# EAGLE schematic final_pcb (EAGLE 9.7.0)
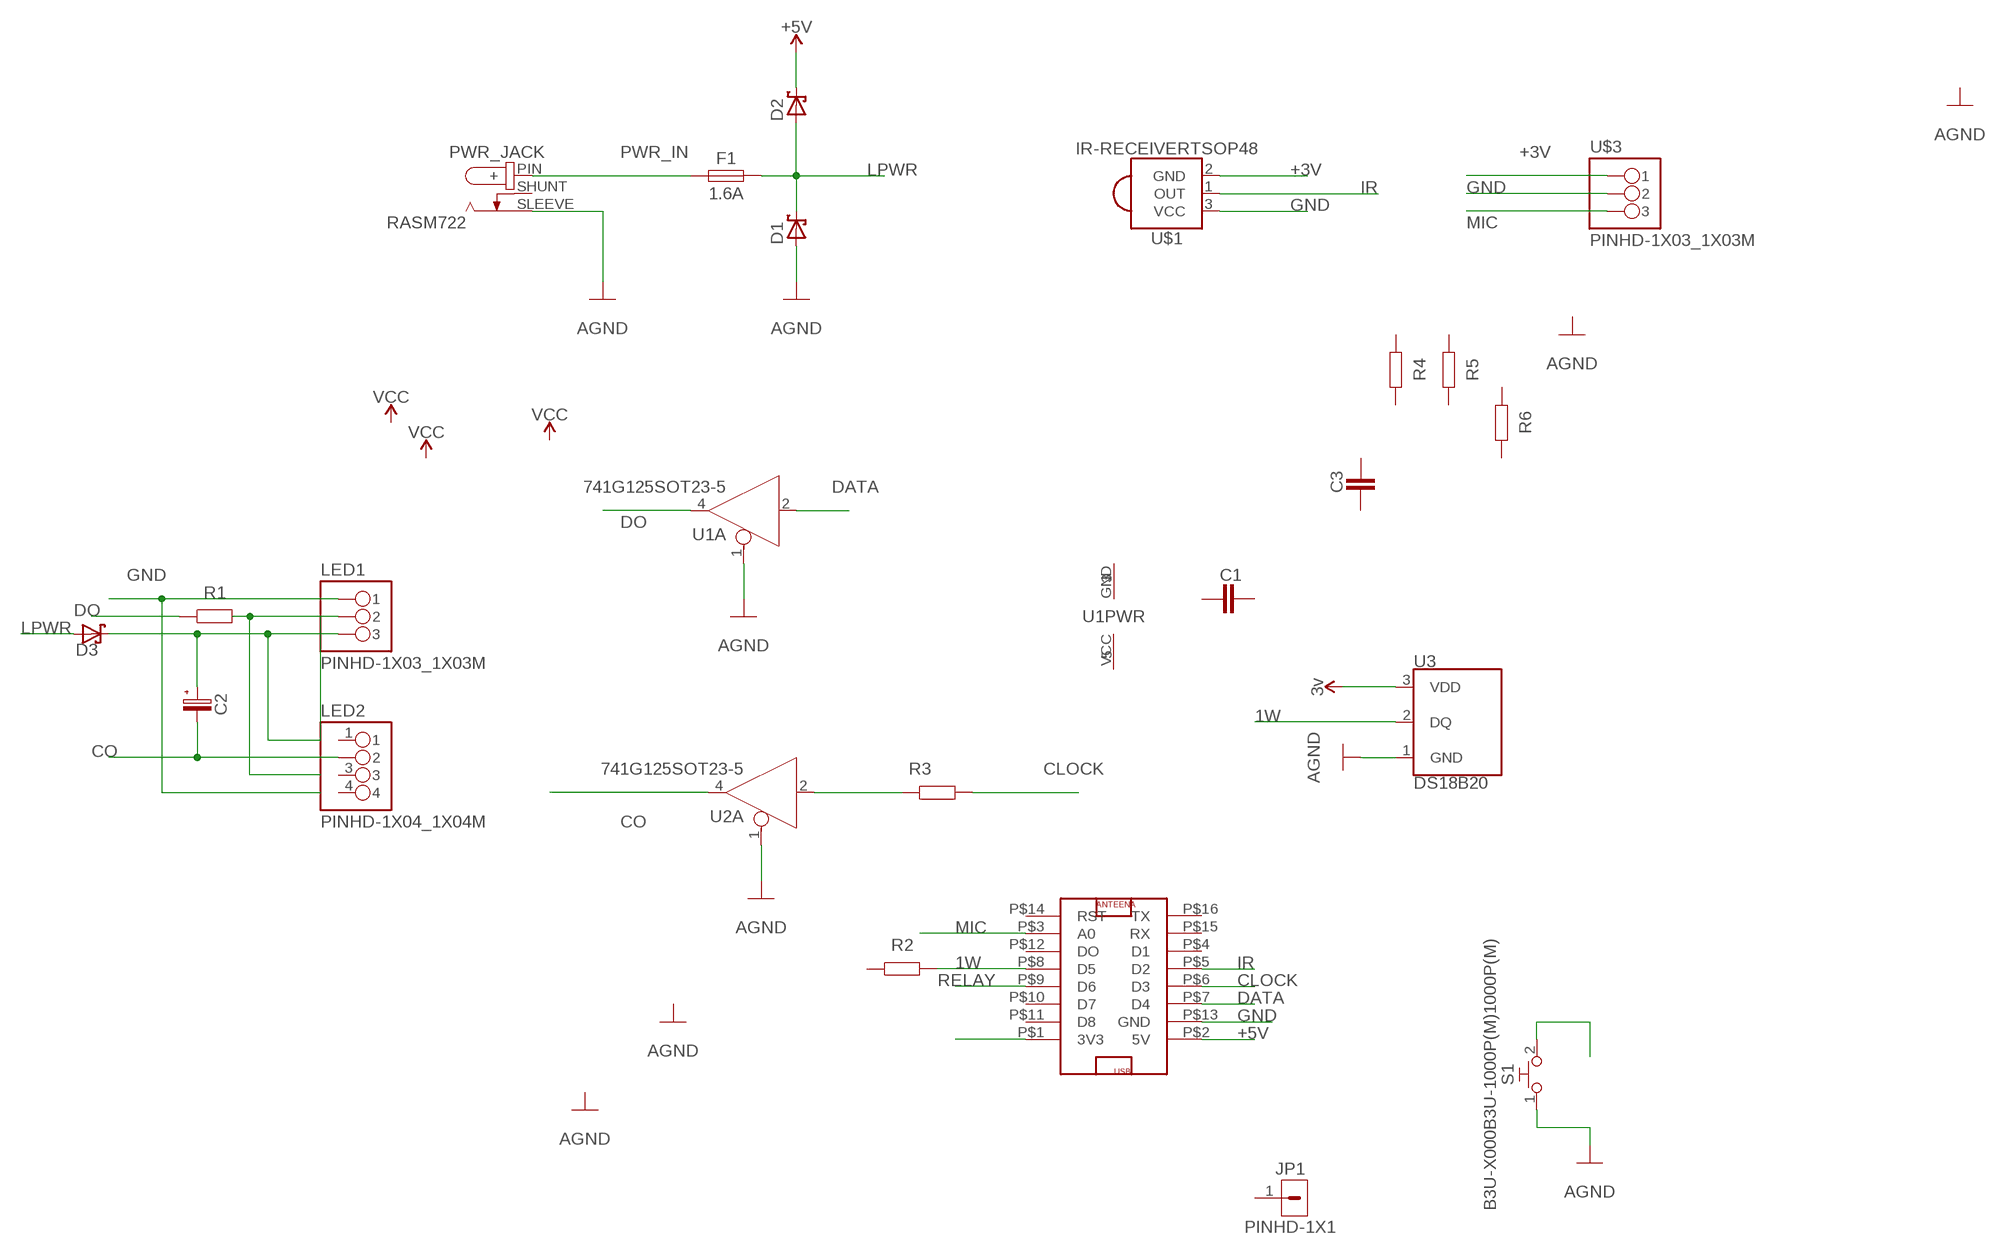
[diagram p0: schematic, sheet 1]

## Parts
C1  CAPACITOR_CHIP-0402(1005-METRIC)  [CAPC1005X60]
C2  C-POL_TANTALUM-1206(3216-METRIC)  [CAPMP3216X180N]
C3  CAPACITOR_CHIP-0402(1005-METRIC)  [CAPC1005X60]
D1  SCHOTTKY-DIODEDO13M  [DO13M]
D2  SCHOTTKY-DIODEDO13M  [DO13M]
D3  SCHOTTKY-DIODEDO13M  [DO13M]
F1  1.6A  FUSE_AXIAL-26MM-PITCH  [FUSAD2590W70L2150D550B]
JP1  PINHD-1X1  [1X01]
LED1  PINHD-1X03_1X03M  [1X03]
LED2  PINHD-1X04_1X04M  [1X04]
PWR_JACK  RASM722  [RASM722X]
R1  R_CHIP-0402(1005-METRIC)  [RESC1005X40]
R2  R_CHIP-0402(1005-METRIC)  [RESC1005X40]
R3  R_CHIP-0402(1005-METRIC)  [RESC1005X40]
R4  R_CHIP-0402(1005-METRIC)  [RESC1005X40]
R5  R_CHIP-0402(1005-METRIC)  [RESC1005X40]
R6  R_CHIP-0402(1005-METRIC)  [RESC1005X40]
S1  B3U-X000B3U-1000P(M)1000P(M)  [B3U-1000P(M)]
U1  741G125SOT23-5  [SOT23-5]
U2  741G125SOT23-5  [SOT23-5]
U3  DS18B20  [TO-92-AMMO]
U$1  IR-RECEIVERTSOP48  [TSOP48]
U$2  WEMOS-D1-MINI  [LAB_PACKAGE]
U$3  PINHD-1X03_1X03M  [1X03]

## Nets
1W: R2.2 U3.2(DQ) U$2.P$8(D5)
+3V: U$1.2(GND) U$3.1
+5V: U$2.P$2(5V)
AGND: D1.A PWR_JACK.SLEEVE(NEG) S1.1 U1.1(A:OE) U2.1(A:OE) U3.1(GND)
CLOCK: R3.2 U$2.P$6(D3)
CO: C2.2(-) LED2.2 U2.4(A:O)
DATA: U1.2(A:I) U$2.P$7(D4)
DO: R1.1 U1.4(A:O)
GND: LED1.1 U$1.3(VCC) U$2.P$13(GND) U$3.2
IR: U$1.1(OUT) U$2.P$5(D2)
LPWR: C2.1(+) D1.C D2.A D3.A D3.C F1.2 LED1.2 LED1.3 R1.2
MIC: U$2.P$3(A0) U$3.3
N$1: U$2.P$1(3V3)
N$2: R3.1 U2.2(A:I)
N$5: S1.2
PWR_IN: F1.1 PWR_JACK.PIN(+)
RELAY: U$2.P$9(D6)
VCC: D2.C U3.3(VDD) ; supply symbol labelled 3v, +5V
Unconnected: C1.1 C1.2 C3.1 C3.2 JP1.1 LED2.1 LED2.3 LED2.4 PWR_JACK.SHUNT(-) R2.1 R4.1 R4.2 R5.1 R5.2 R6.1 R6.2 U$2.P$4(D1) U$2.P$10(D7) U$2.P$11(D8) U$2.P$12(DO) U$2.P$14(RST) U$2.P$15(RX) U$2.P$16(TX)

## Power pins joined to a net without a drawn wire
GND: U1.3(PWR:GND) U2.3(PWR:GND)
VCC: U1.5(PWR:VCC) U2.5(PWR:VCC)

## Library data of the parts
C1 C3 = Tinkercad:CAPACITOR: Capacitor - Generic; CATEGORY: Capacitor
C2 = Capacitor:C-POL: Capacitor Polarised - Generic; CATEGORY_L1: Capacitor; CATEGORY_L2: Tantalum Capacitors; CATEGORY_L3: Polymer Capacitors; PACKAGE: Surface Mount; PACKAGE_SIZE: 1206
D1-D3 = adafruit:SCHOTTKY-DIODE: Schottky Diode
F1 = Circuit-Protection:FUSE: Fuse - Generic; CATEGORY_L1: Circuit Protection; CATEGORY_L2: Fuses; CATEGORY_L3: Axial; PACKAGE: Through Hole; PACKAGE_SIZE: 26MM-PITCH
JP1 = Connector:PINHD-1X1: Pin Header; CATEGORY_L1: Connectors; CATEGORY_L2: Headers; CATEGORY_L3: Male Pins; DESCRIPTION: Header-Straight-1 Position; PACKAGE: Through Hole; PITCH: 0.100" (2.54mm)
LED1 U$3 = Tinkercad:PINHD-1X03
LED2 = Tinkercad:PINHD-1X04
PWR_JACK = Connector:RASM722: CONN PWR JACK 2.1X5.5MM SOLDER; CATEGORY_L1: Connectors; CATEGORY_L2: Power Connectors; CATEGORY_L3: Barrel Connectors; DATASHEET: https://www.switchcraft.com/assets/1/24/rasm722x_cd.pdf; DESCRIPTION: Power Barrel Connector Jack 2.10mm ID (0.083 inch) 5.50mm OD (0.217 inch) Surface Mount Right Angle; MANUFACTURER: Switchcraft Inc.; MPN: RASM722X; OPERATING_TEMPERATURE: -55°C ~ 85°C; PACKAGE: Through Hole; PACKAGE_SIZE: NA; PART_STATUS: Active; PITCH: NA; ROHS: Compliant; SERIES: RASM72
R1-R6 = Resistor:R: Resistor Fixed - Generic; CATEGORY_L1: Resistors; DESCRIPTION: Chip Resistor 1.05 X 0.54 X 0.40 mm body 0402(1005-METRIC) Package; PACKAGE: Surface Mount; PACKAGE_SIZE: 0402
S1 = Switch:B3U-X000: Ultra-small Tactile Switch Contact form : SPST-NO Reference: Datasheet <https://omronfs.omron.com/en_US/ecb/products/pdf/en-b3u.pdf>; CATEGORY_L1: Switches; CATEGORY_L2: Tactile Switches; CATEGORY_L3: SPST-NO; DATASHEET: https://omronfs.omron.com/en_US/ecb/products/pdf/en-b3u.pdf; DESCRIPTION: Tactile Switch SPST-NO Top Actuated Surface Mount; MANUFACTURER: Omron Electronics Inc-EMC Div; MPN: B3U-1000PM; OPERATING_TEMPERATURE: -25°C ~ 70°C; PACKAGE: Surface Mount; PACKAGE_SIZE: NA; PART_STATUS: Active; ROHS: Compliant; SERIES: B3U
U1 U2 = IC_Logic:74*1G125: Single Bus Buffer Gate with 3-State Output; CATEGORY_L1: Logic ICs; CATEGORY_L2: Buffers Drivers & Receivers; CATEGORY_L3: Buffer & Non-Inverting; DATASHEET: https://rocelec.widen.net/view/pdf/lbrjf066uz/ONSMS09389-1.pdf?t.download=true&u=5oefqw; DESCRIPTION: Buffer Non-Inverting 1 Element 1 Bit per Element 3-State Output 5-TSOP; MANUFACTURER: onsemi; MPN: MC74VHC1GT125D1G; OPERATING_TEMPERATURE: -55°C ~ 125°C; PACKAGE: Surface Mount; PACKAGE_SIZE: SOT-23-5; PART_STATUS: Active; ROHS: Compliant; SERIES: 74VHC
U3 = SparkFun-Sensors:DS18B20: Dallas/Maxim DS18B20 1-Wire Temperature Sensor The DS18B20 reports degrees C with 9 to 12-bit precision, -55C to 125C (+/-0.5C). Each sensor has a unique 64-Bit Serial number etched into it - allows for a huge number of sensors to be used on one data bus. Datasheet <http://datasheets.maximintegrated.com/en/ds/DS18B20.pdf> SparkFun Products One Wire Digital Temperature Sensor - DS18B20 <https://www.sparkfun.com/products/245> (SEN-00245); STORE_ID: SEN-00245
U$1 = Tinkercad:IR-RECEIVER
U$2 = LAMP:WEMOS-D1-MINI